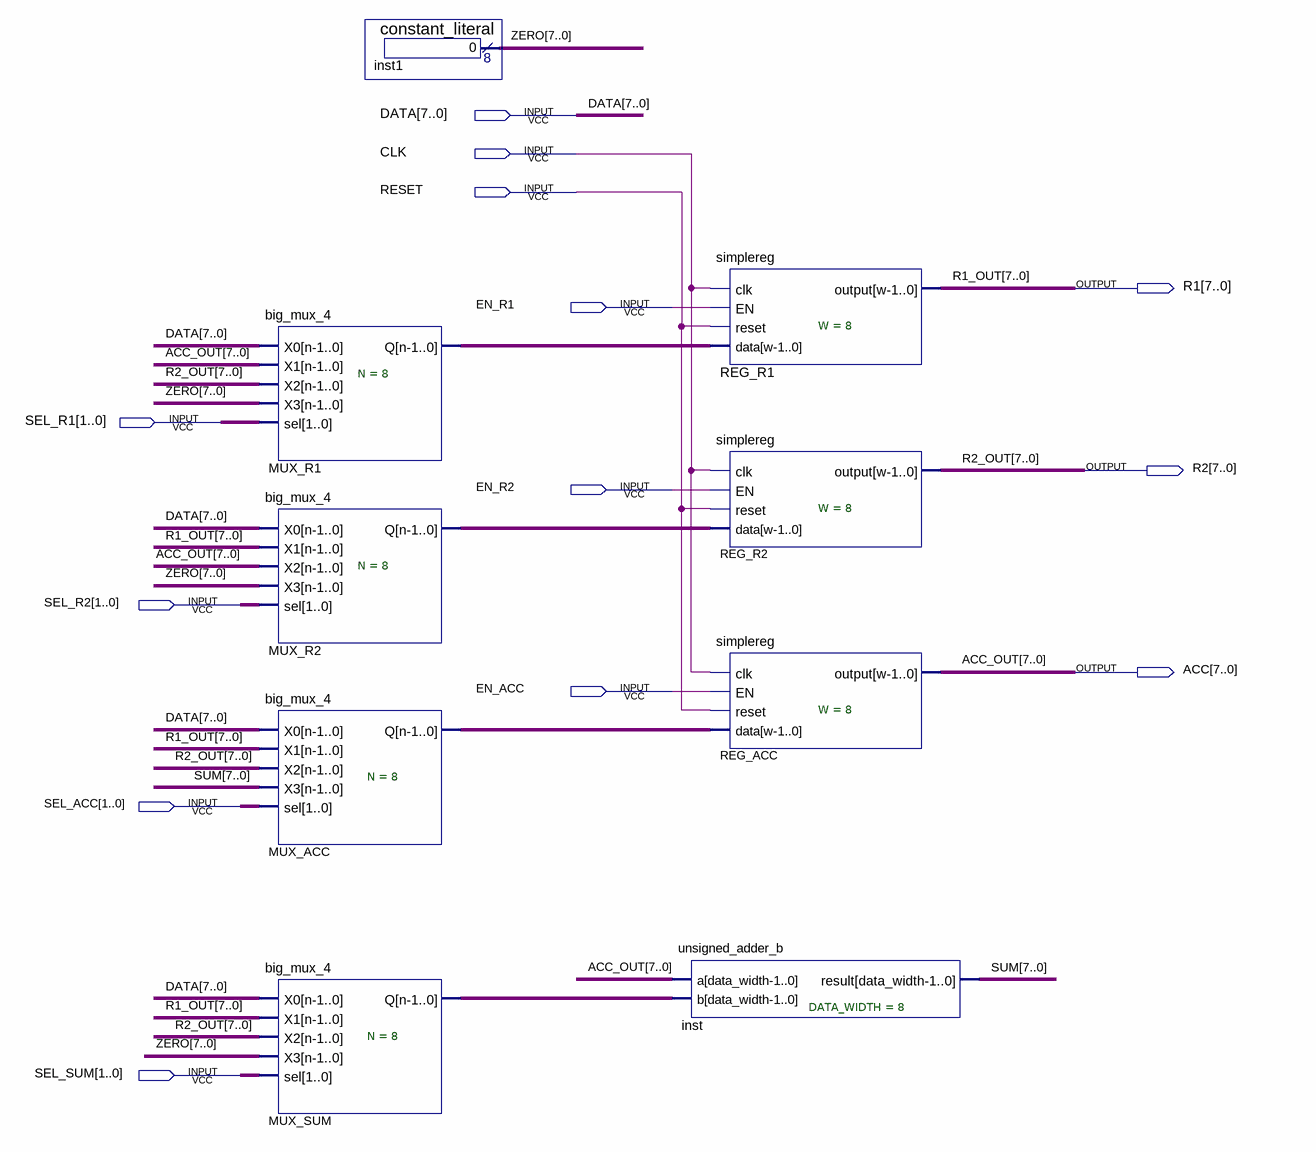
[diagram p0: schematic sheet]
// Quartus schematic ControllerDatapath.bdf as structural Verilog: 9 symbols, 13 pins
module ControllerDatapath (
  input  [7:0] DATA,
  input  CLK,
  input  RESET,
  input  EN_R1,
  input  [1:0] SEL_R1,
  input  EN_R2,
  input  [1:0] SEL_R2,
  input  EN_ACC,
  input  [1:0] SEL_ACC,
  input  [1:0] SEL_SUM,
  output [7:0] R1,
  output [7:0] R2,
  output [7:0] ACC
);

  wire [7:0] MUX_ACC_q, MUX_R1_q, MUX_R2_q, MUX_SUM_q, SUM, ZERO;

  big_mux_4 #(.N(8)) MUX_R1 (.X0(DATA), .X1(ACC), .X2(R2), .X3(ZERO), .sel(SEL_R1), .Q(MUX_R1_q));
  big_mux_4 #(.N(8)) MUX_R2 (.X0(DATA), .X1(R1), .X2(ACC), .X3(ZERO), .sel(SEL_R2), .Q(MUX_R2_q));
  big_mux_4 #(.N(8)) MUX_ACC (.X0(DATA), .X1(R1), .X2(R2), .X3(SUM), .sel(SEL_ACC), .Q(MUX_ACC_q));
  big_mux_4 #(.N(8)) MUX_SUM (.X0(DATA), .X1(R1), .X2(R2), .X3(ZERO), .sel(SEL_SUM), .Q(MUX_SUM_q));
  constant_literal inst1 (.result(ZERO));
  unsigned_adder_b #(.DATA_WIDTH(8)) inst (.a(ACC), .b(MUX_SUM_q), .result(SUM));
  simplereg #(.W(8)) REG_R1 (.clk(CLK), .EN(EN_R1), .reset(RESET), .data(MUX_R1_q), .\output (R1));
  simplereg #(.W(8)) REG_R2 (.clk(CLK), .EN(EN_R2), .reset(RESET), .data(MUX_R2_q), .\output (R2));
  simplereg #(.W(8)) REG_ACC (.clk(CLK), .EN(EN_ACC), .reset(RESET), .data(MUX_ACC_q), .\output (ACC));

  // Other names for the same wires on the sheet: ACC_OUT[7:0] = ACC; R1_OUT[7:0] = R1; R2_OUT[7:0] = R2
endmodule
